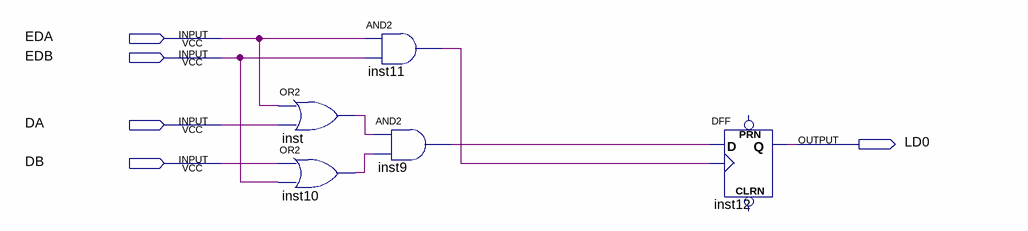
[diagram p0: schematic sheet]
// Quartus schematic 2buferedgeedge1b.bdf as structural Verilog: 5 symbols, 5 pins
module \2buferedgeedge1b  (
  input  EDA,
  input  EDB,
  input  DA,
  input  DB,
  output LD0
);

  wire inst9_out, inst10_out, inst11_out, inst_out;

  or inst (inst_out, EDA, DA);
  or inst10 (inst10_out, DB, EDB);
  and inst11 (inst11_out, EDA, EDB);
  and inst9 (inst9_out, inst_out, inst10_out);
  DFF inst12 (.CLK(inst11_out), .D(inst9_out), .Q(LD0));  // open: CLRN, PRN
endmodule
